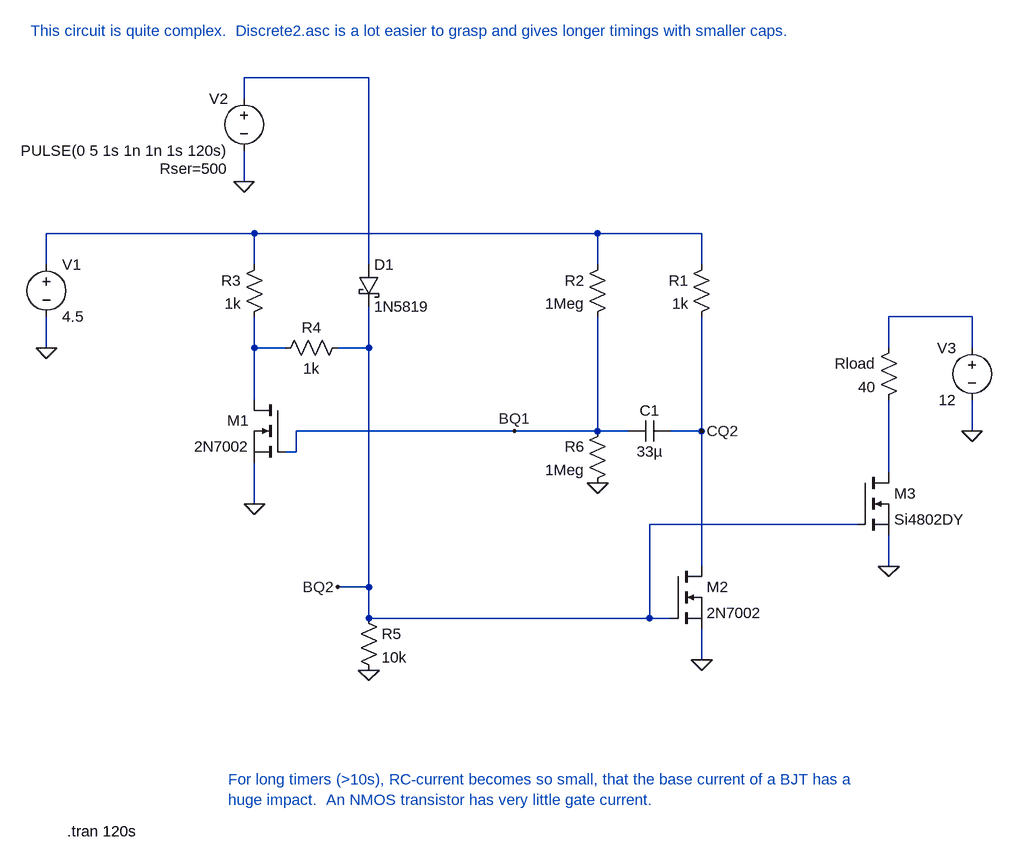
[diagram p0: schematic discrete.asc]
discrete.asc, the LTspice schematic file:
Version 4
SHEET 1 964 744
WIRE -64 -432 -256 -432
WIRE -256 -400 -256 -432
WIRE -256 -272 -256 -320
WIRE -240 -192 -560 -192
WIRE 288 -192 -240 -192
WIRE 448 -192 288 -192
WIRE -560 -144 -560 -192
WIRE -240 -144 -240 -192
WIRE -64 -144 -64 -432
WIRE 288 -144 288 -192
WIRE 448 -144 448 -192
WIRE 864 -64 736 -64
WIRE -560 -16 -560 -64
WIRE -240 -16 -240 -64
WIRE -192 -16 -240 -16
WIRE -64 -16 -64 -80
WIRE -64 -16 -112 -16
WIRE 736 -16 736 -64
WIRE 864 -16 864 -64
WIRE -240 64 -240 -16
WIRE 160 112 -176 112
WIRE 288 112 288 -64
WIRE 288 112 160 112
WIRE 336 112 288 112
WIRE 448 112 448 -64
WIRE 448 112 400 112
WIRE 864 112 864 64
WIRE -176 144 -176 112
WIRE -176 144 -192 144
WIRE 736 176 736 64
WIRE -240 224 -240 160
WIRE 688 256 368 256
WIRE 448 320 448 112
WIRE 736 320 736 272
WIRE -64 352 -64 -16
WIRE -64 352 -112 352
WIRE -64 400 -64 352
WIRE 368 400 368 256
WIRE 368 400 -64 400
WIRE 400 400 368 400
WIRE 448 464 448 416
FLAG -560 -16 0
FLAG 448 464 0
FLAG -240 224 0
FLAG -256 -272 0
FLAG 448 112 CQ2
FLAG 160 112 BQ1
FLAG -112 352 BQ2
FLAG -64 480 0
FLAG 288 192 0
FLAG 736 320 0
FLAG 864 112 0
SYMBOL res 464 -160 M0
SYMATTR InstName R1
SYMATTR Value 1k
SYMBOL res 304 -160 M0
SYMATTR InstName R2
SYMATTR Value 1Meg
SYMBOL res -224 -160 M0
SYMATTR InstName R3
SYMATTR Value 1k
SYMBOL cap 336 96 M90
WINDOW 0 0 32 VBottom 2
WINDOW 3 32 32 VTop 2
SYMATTR InstName C1
SYMATTR Value 33µ
SYMBOL voltage -560 -160 R0
SYMATTR InstName V1
SYMATTR Value 4.5
SYMBOL voltage -256 -416 M0
WINDOW 123 0 0 Left 0
WINDOW 39 24 124 Left 2
SYMATTR SpiceLine Rser=500
SYMATTR InstName V2
SYMATTR Value PULSE(0 5 1s 1n 1n 1s 120s)
SYMBOL schottky -80 -144 R0
SYMATTR InstName D1
SYMATTR Value 1N5819
SYMATTR Description Diode
SYMATTR Type diode
SYMBOL res -80 384 R0
SYMATTR InstName R5
SYMATTR Value 10k
SYMBOL res 304 96 M0
SYMATTR InstName R6
SYMATTR Value 1Meg
SYMBOL res 752 -32 M0
SYMATTR InstName Rload
SYMATTR Value 40
SYMBOL nmos -192 64 M0
SYMATTR InstName M1
SYMATTR Value 2N7002
SYMBOL nmos 400 320 R0
SYMATTR InstName M2
SYMATTR Value 2N7002
SYMBOL nmos 688 176 R0
SYMATTR InstName M3
SYMATTR Value Si4802DY
SYMBOL voltage 864 -32 M0
SYMATTR InstName V3
SYMATTR Value 12
SYMBOL res -96 -32 R90
WINDOW 0 0 56 VBottom 2
WINDOW 3 32 56 VTop 2
SYMATTR InstName R4
SYMATTR Value 1k
TEXT -528 728 Left 2 !.tran 120s
TEXT -280 648 Left 2 ;For long timers (>10s), RC-current becomes so small, that the base current of a BJT has a\nhuge impact.  An NMOS transistor has very little gate current.
TEXT -584 -504 Left 2 ;This circuit is quite complex.  Discrete2.asc is a lot easier to grasp and gives longer timings with smaller caps.

The netlist it stands for:
* discrete.asc
R1 N002 CQ2 1k
R2 N002 BQ1 1Meg
R3 N002 N004 1k
C1 BQ1 CQ2 33µ
V1 N002 0 4.5
V2 N001 0 PULSE(0 5 1s 1n 1n 1s 120s) Rser=500
D1 N001 BQ2 1N5819
R5 BQ2 0 10k
R6 BQ1 0 1Meg
Rload N003 N005 40
M1 N004 BQ1 0 0 2N7002
M2 CQ2 BQ2 0 0 2N7002
M3 N005 BQ2 0 0 Si4802DY
V3 N003 0 12
R4 BQ2 N004 1k
.model D D
.lib standard.dio
.model NMOS NMOS
.model PMOS PMOS
.lib standard.mos
.tran 120s
* For long timers (>10s), RC-current becomes so small, that the base current of a BJT has a
* huge impact.  An NMOS transistor has very little gate current.
* This circuit is quite complex.  Discrete2.asc is a lot easier to grasp and gives longer timings with smaller caps.
.backanno
.end